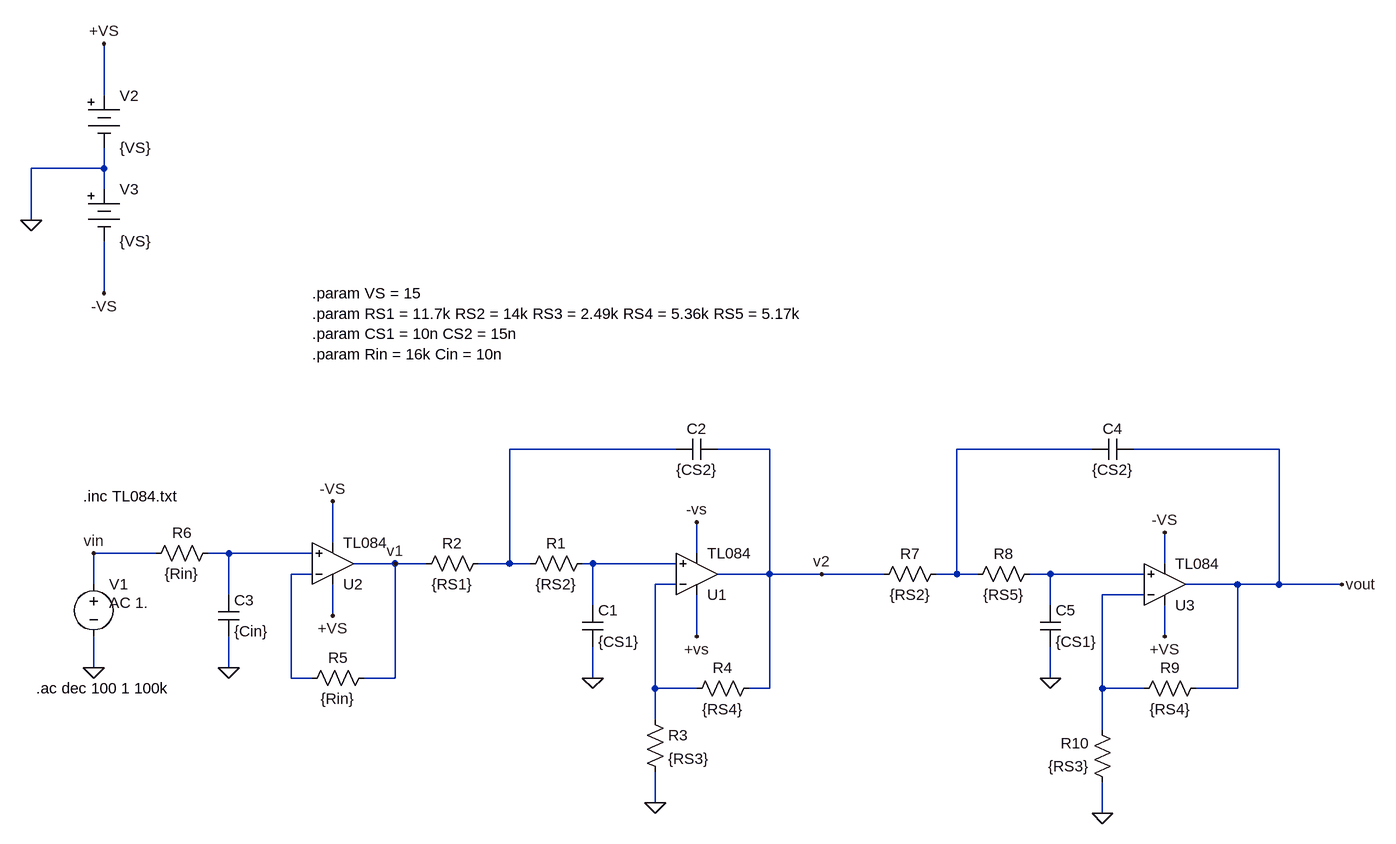
[diagram p0: schematic active_filter.asc]
active_filter.asc, the LTspice schematic file:
Version 4.1
SHEET 1 1492 680
WIRE -480 -896 -480 -976
WIRE -480 -784 -480 -816
WIRE -480 -784 -592 -784
WIRE -480 -752 -480 -784
WIRE -592 -704 -592 -784
WIRE -480 -592 -480 -672
WIRE 400 -352 144 -352
WIRE 544 -352 464 -352
WIRE 1040 -352 832 -352
WIRE 1328 -352 1104 -352
WIRE -128 -208 -128 -272
WIRE -400 -192 -496 -192
WIRE -288 -192 -320 -192
WIRE -160 -192 -288 -192
WIRE 432 -192 432 -240
WIRE -32 -176 -96 -176
WIRE 16 -176 -32 -176
WIRE 144 -176 144 -352
WIRE 144 -176 96 -176
WIRE 176 -176 144 -176
WIRE 272 -176 256 -176
WIRE 400 -176 272 -176
WIRE 1152 -176 1152 -224
WIRE -160 -160 -192 -160
WIRE 544 -160 544 -352
WIRE 544 -160 464 -160
WIRE 624 -160 544 -160
WIRE 720 -160 624 -160
WIRE 832 -160 832 -352
WIRE 832 -160 800 -160
WIRE 864 -160 832 -160
WIRE 976 -160 944 -160
WIRE 1120 -160 976 -160
WIRE -496 -144 -496 -192
WIRE 400 -144 368 -144
WIRE 1264 -144 1184 -144
WIRE 1328 -144 1328 -352
WIRE 1328 -144 1264 -144
WIRE 1424 -144 1328 -144
WIRE -288 -128 -288 -192
WIRE 1120 -128 1056 -128
WIRE 272 -112 272 -176
WIRE 976 -112 976 -160
WIRE -128 -96 -128 -144
WIRE 432 -64 432 -128
WIRE 1152 -64 1152 -112
WIRE -496 -16 -496 -64
WIRE -288 -16 -288 -64
WIRE -192 0 -192 -160
WIRE -160 0 -192 0
WIRE -32 0 -32 -176
WIRE -32 0 -80 0
WIRE 272 0 272 -48
WIRE 976 0 976 -48
WIRE 368 16 368 -144
WIRE 432 16 368 16
WIRE 544 16 544 -160
WIRE 544 16 512 16
WIRE 1056 16 1056 -128
WIRE 1120 16 1056 16
WIRE 1264 16 1264 -144
WIRE 1264 16 1200 16
WIRE 368 64 368 16
WIRE 1056 80 1056 16
WIRE 368 192 368 144
WIRE 1056 208 1056 160
FLAG 272 0 0
FLAG 432 -64 +vs
FLAG 432 -240 -vs
FLAG -128 -272 -VS
FLAG -128 -96 +VS
FLAG -288 -16 0
FLAG -496 -16 0
FLAG 1424 -144 vout
FLAG -592 -704 0
FLAG -480 -976 +VS
FLAG -480 -592 -VS
FLAG 368 192 0
FLAG 1152 -64 +VS
FLAG 1152 -224 -VS
FLAG 1056 208 0
FLAG 976 0 0
FLAG -32 -176 v1
FLAG 624 -160 v2
FLAG -496 -192 vin
SYMBOL res 272 -192 R90
WINDOW 0 0 56 VBottom 2
WINDOW 3 32 56 VTop 2
SYMATTR InstName R1
SYMATTR Value {RS2}
SYMBOL res 112 -192 R90
WINDOW 0 0 56 VBottom 2
WINDOW 3 32 56 VTop 2
SYMATTR InstName R2
SYMATTR Value {RS1}
SYMBOL cap 256 -112 R0
SYMATTR InstName C1
SYMATTR Value {CS1}
SYMBOL cap 464 -368 R90
WINDOW 0 0 32 VBottom 2
WINDOW 3 32 32 VTop 2
SYMATTR InstName C2
SYMATTR Value {CS2}
SYMBOL res 352 48 R0
SYMATTR InstName R3
SYMATTR Value {RS3}
SYMBOL res 528 0 R90
WINDOW 0 0 56 VBottom 2
WINDOW 3 32 56 VTop 2
SYMATTR InstName R4
SYMATTR Value {RS4}
SYMBOL res -64 -16 R90
WINDOW 0 0 56 VBottom 2
WINDOW 3 32 56 VTop 2
SYMATTR InstName R5
SYMATTR Value {Rin}
SYMBOL res -304 -208 R90
WINDOW 0 0 56 VBottom 2
WINDOW 3 32 56 VTop 2
SYMATTR InstName R6
SYMATTR Value {Rin}
SYMBOL cap -304 -128 R0
SYMATTR InstName C3
SYMATTR Value {Cin}
SYMBOL voltage -496 -160 R0
WINDOW 123 24 44 Left 2
WINDOW 39 0 0 Left 0
SYMATTR Value2 AC 1.
SYMATTR InstName V1
SYMATTR Value ""
SYMBOL Misc\\battery -480 -912 R0
SYMATTR InstName V2
SYMATTR Value {VS}
SYMBOL Misc\\battery -480 -768 R0
SYMATTR InstName V3
SYMATTR Value {VS}
SYMBOL res 816 -176 R90
WINDOW 0 0 56 VBottom 2
WINDOW 3 32 56 VTop 2
SYMATTR InstName R7
SYMATTR Value {RS2}
SYMBOL res 960 -176 R90
WINDOW 0 0 56 VBottom 2
WINDOW 3 32 56 VTop 2
SYMATTR InstName R8
SYMATTR Value {RS5}
SYMBOL res 1216 0 R90
WINDOW 0 0 56 VBottom 2
WINDOW 3 32 56 VTop 2
SYMATTR InstName R9
SYMATTR Value {RS4}
SYMBOL res 1072 176 R180
WINDOW 0 36 76 Left 2
WINDOW 3 36 40 Left 2
SYMATTR InstName R10
SYMATTR Value {RS3}
SYMBOL cap 1104 -368 R90
WINDOW 0 0 32 VBottom 2
WINDOW 3 32 32 VTop 2
SYMATTR InstName C4
SYMATTR Value {CS2}
SYMBOL cap 960 -48 M180
WINDOW 0 24 56 Left 2
WINDOW 3 24 8 Left 2
SYMATTR InstName C5
SYMATTR Value {CS1}
SYMBOL OpAmps\\opamp2 -128 -112 M180
SYMATTR InstName U2
SYMATTR Value TL084
SYMBOL OpAmps\\opamp2 432 -96 M180
SYMATTR InstName U1
SYMATTR Value TL084
SYMBOL OpAmps\\opamp2 1152 -80 M180
SYMATTR InstName U3
SYMATTR Value TL084
TEXT -160 -592 Left 2 !.param VS = 15\n.param RS1 = 11.7k RS2 = 14k RS3 = 2.49k RS4 = 5.36k RS5 = 5.17k\n.param CS1 = 10n CS2 = 15n\n.param Rin = 16k Cin = 10n
TEXT -584 16 Left 2 !.ac dec 100 1 100k
TEXT -512 -280 Left 2 !.inc TL084.txt

The netlist it stands for:
* active_filter.asc
R1 N004 N001 {RS2}
R2 N001 v1 {RS1}
C1 N004 0 {CS1}
C2 v2 N001 {CS2}
R3 N007 0 {RS3}
R4 v2 N007 {RS4}
R5 v1 N005 {Rin}
R6 N003 vin {Rin}
C3 N003 0 {Cin}
V1 vin 0 AC 1.
V2 +vs 0 {VS}
V3 0 -vs {VS}
R7 N002 v2 {RS2}
R8 N006 N002 {RS5}
R9 vout N008 {RS4}
R10 0 N008 {RS3}
C4 vout N002 {CS2}
C5 0 N006 {CS1}
X§U2 N003 N005 +vs -vs v1 TL084  ; pins In+ In- V+ V- OUT
X§U1 N004 N007 +vs -vs v2 TL084  ; pins In+ In- V+ V- OUT
X§U3 N006 N008 +vs -vs vout TL084  ; pins In+ In- V+ V- OUT
.param VS = 15
.param RS1 = 11.7k RS2 = 14k RS3 = 2.49k RS4 = 5.36k RS5 = 5.17k
.param CS1 = 10n CS2 = 15n
.param Rin = 16k Cin = 10n
.ac dec 100 1 100k
.inc TL084.txt
.backanno
.end